# Altium schematic sheet AFF.SchDoc
size A4; SheetNumber: 4; SheetTotal: 5
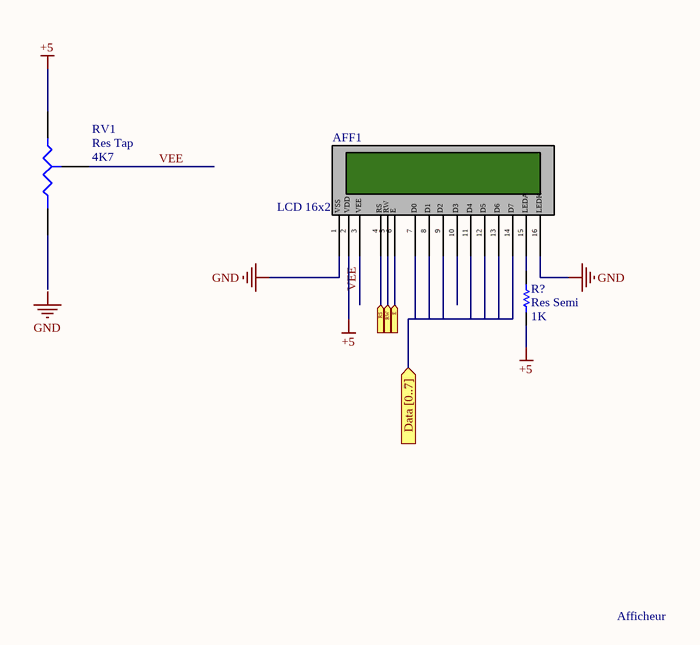
[diagram p0: AFF.SchDoc]

## Parts
AFF1  LCD 16x2
R?  Res Semi  value 1K  [AXIAL-0.5]
RV1  Res Tap  value 4K7  [VR3]

## Ports
Data [0..7] (in), E (in), RS (in), RW (in)

## Nets
+5: AFF1.2 R?.1 RV1.1(A)
GND: AFF1.1 AFF1.16
E: AFF1.6 ; port E
RS: AFF1.4 ; port RS
RW: AFF1.5 ; port RW
VEE: AFF1.3 RV1.3(TAP)
NetAFF1_15: AFF1.15 R?.2

Not connected (* = marked no-connect by the designer): AFF1 7 8 9 10 11 12 13 14; RV1 2(B)

## Notes on the sheet
- Afficheur
- Labels drawn without touching a wire or pin: GND
- (in symbol LCD 16x2) VSS; VDD; VEE; RS; RW; E; D0; D1; D2; D3; D4; D5; D6; D7; LEDA; LEDK

## Library data of the parts
R? = Res Semi: Semiconductor Resistor; Published: 8-Jun-2000; LatestRevisionDate: 17-Jul-2002; LatestRevisionNote: Re-released for DXP Platform.; PackageReference: AXIAL-0.5; Publisher: Altium Limited; PackageDescription: Axial Device, Thru-Hole; 2 Leads; 0.5 in Pin Spacing
RV1 = Res Tap: Tapped Resistor; Sim Note: Enter the Resistance value and the set point into parameter fields.; Set Position: 0.5; Published: 24-Mar-1999; LatestRevisionDate: 17-Jul-2002; LatestRevisionNote: Re-released for DXP Platform.; PackageReference: VR3; Publisher: Altium Limited; PackageDescription: Variable Resistor, Thru-Hole; 3 Leads